# EAGLE design smd_esp8266 (EAGLE 9.6.0)
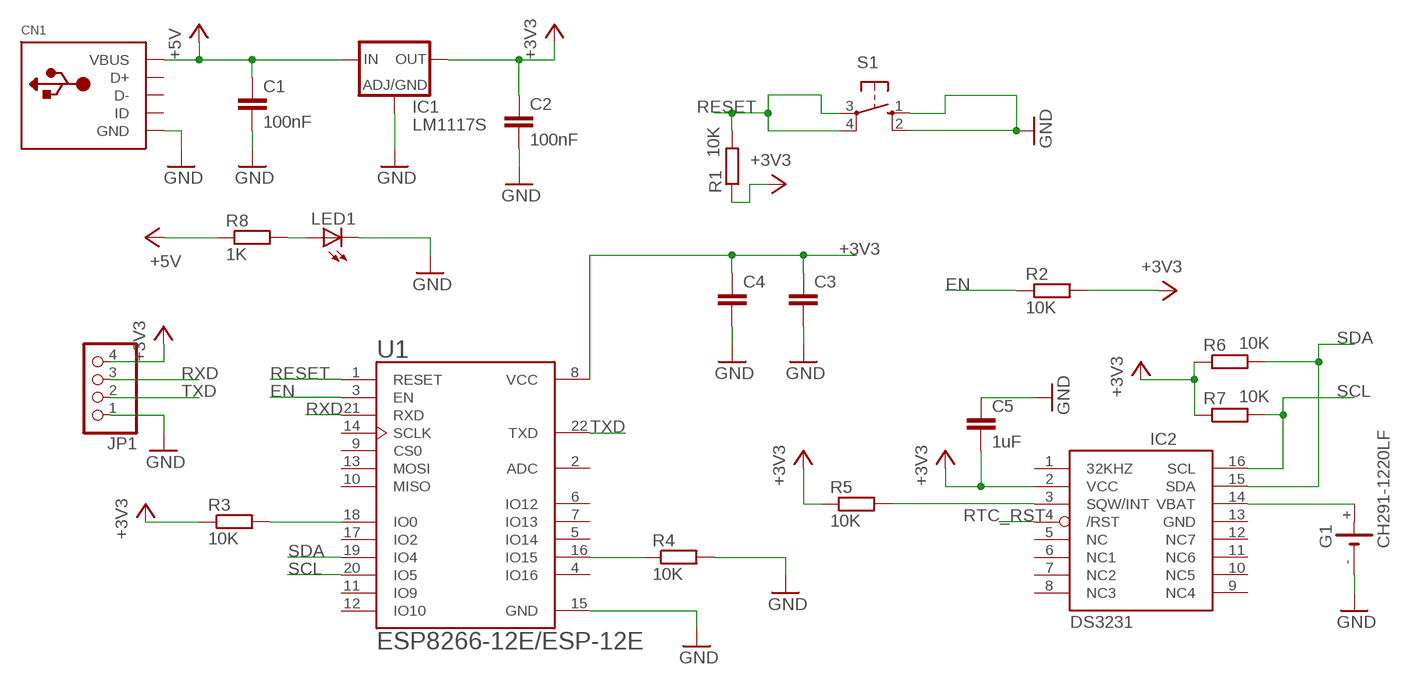
[diagram p0: schematic, sheet 1]

## Parts
C1  100nF  C-EUC0805  [C0805]
C2  100nF  C-EUC0805  [C0805]
C3  C-EUC0805  [C0805]
C4  C-EUC0805  [C0805]
C5  1uF  C-EUC0805  [C0805]
CN1  USBMINIB  [USB-MINIB]
G1  CH291-1220LF  [CH291-1220LF]
IC1  LM1117S  [SOT223]
IC2  DS3231/SO  [SO16W]
JP1  PINHD-1X4  [1X04]
LED1  LEDCHIP-LED0805  [CHIP-LED0805]
R1  10K  R-EU_R0805  [R0805]
R2  10K  R-EU_R0805  [R0805]
R3  10K  R-EU_R0805  [R0805]
R4  10K  R-EU_R0805  [R0805]
R5  10K  R-EU_R0805  [R0805]
R6  10K  R-EU_R0805  [R0805]
R7  10K  R-EU_R0805  [R0805]
R8  1K  R-EU_R0805  [R0805]
S1  10-XX  [B3F-10XX]
U1  ESP8266-12E/ESP-12E  [XCVR_ESP8266-12E/ESP-12E]

## Nets
+3V3: C2.1 C3.1 C4.1 C5.2 IC1.2(OUT) IC1.4(OUT) IC2.2(VCC) JP1.4 R1.1 R2.2 R3.1 R5.1 R6.1 R7.1 U1.8(VCC)
+5V: C1.1 CN1.VBUS IC1.3(IN) R8.1
EN: R2.1 U1.3(EN)
GND: C1.2 C2.2 C3.2 C4.2 C5.1 CN1.GND G1.- IC1.1(ADJ) JP1.1 LED1.C R4.2 S1.1(S) S1.2(S1) U1.15(GND)
N$1: R3.2 U1.18(IO0)
N$2: R4.1 U1.16(IO15)
N$3: IC2.3(SQW/INT) R5.2
N$4: G1.+ IC2.14(VBAT)
N$5: LED1.A R8.2
RESET: R1.2 S1.3(P) S1.4(P1) U1.1(RESET)
RTC_RST: IC2.4(/RST)
RXD: JP1.3 U1.21(RXD)
SCL: IC2.16(SCL) R7.2 U1.20(IO5)
SDA: IC2.15(SDA) R6.2 U1.19(IO4)
TXD: JP1.2 U1.22(TXD)
Unconnected: CN1.D+ CN1.D- CN1.ID IC2.1(32KHZ) IC2.5(NC) IC2.6(NC1) IC2.7(NC2) IC2.8(NC3) IC2.9(NC4) IC2.10(NC5) IC2.11(NC6) IC2.12(NC7) U1.2(ADC) U1.4(IO16) U1.5(IO14) U1.6(IO12) U1.7(IO13) U1.9(CS0) U1.10(MISO) U1.11(IO9) U1.12(IO10) U1.13(MOSI) U1.14(SCLK) U1.17(IO2)

## Power pins joined to a net without a drawn wire
GND: IC2.13(GND)

## Library data of the parts
C1-C5 = rcl:C-EU: CAPACITOR, European symbol; SPICEPREFIX: C
CN1 = adafruit:USB: USB Connectors USBMINIB - Surface Mount Female Mini-B USB Connector 4UConnector: 06564 By microbuilder.eu Thru-hole RA Female Mini-B USB Connector 4UConnector: 18732 By ladyada.net
G1 = battery:CH291-1220LF: Battery Holder, SMT, 12mm multicomp PART NO. CH291-1220LF Source: Data sheet <http://www.farnell.com/datasheets/1505860.pdf>
IC1 = LM1117:LM1117: Low drop fixed and adjustable positive voltage regulators 1 A Source: http://www.st.com/stonline/products/literature/ds/7194/ld1117axx.pdf; AVAILABILITY: Unavailable; DESCRIPTION: Linear Voltage Regulator IC 1 Output 800mA SOT-223-4; MF: Texas Instruments; MP: LM1117; PACKAGE: SOT-223-4 Texas Instruments; PRICE: None
IC2 = DS3231:DS3231; AVAILABILITY: Unavailable; DESCRIPTION: Real Time Clock _RTC_ IC Clock/Calendar I²C, 2-Wire Serial 16-SOIC _0.295, 7.50mm Width_; MF: Maxim Integrated; MP: DS3231; PACKAGE: SOIC-16 Maxim Integrated; PRICE: None
JP1 = pinhead:PINHD-1X4: PIN HEADER
LED1 = adafruit:LED: LED OSRAM: - CHIPLED LG R971, LG N971, LY N971, LG Q971, LY Q971, LO R971, LY R971 LH N974, LH R974 LS Q976, LO Q976, LY Q976 LO Q996 - Hyper CHIPLED LW Q18S LB Q993, LB Q99A, LB R99A - SideLED LS A670, LO A670, LY A670, LG A670, LP A670 LB A673, LV A673, LT A673, LW A673 LH A674 LY A675 LS A676, LA A676, LO A676, LY A676, LW A676 LS A679, LY A679, LG A679 - Hyper Micro SIDELED® LS Y876, LA Y876, LO Y876, LY Y876 LT Y87S - SmartLED LW L88C, LW L88S LB L89C, LB L89S, LG L890 LS L89K, LO L89K, LY L89K LS L896, LA L896, LO L896, LY L896 - TOPLED LS T670, LO T670, LY T670, LG T670, LP T670 LSG T670, LSP T670, LSY T670, LOP T670, LYG T670 LG T671, LOG T671, LSG T671 LB T673, LV T673, LT T673, LW T673 LH T674 LS T676, LA T676, LO T676, LY T676, LB T676, LH T676, LSB T676, LW T676 LB T67C, LV T67C, LT T67C, LS T67K, LO T67K, LY T67K, LW E67C LS E67B, LA E67B, LO E67B, LY E67B, LB E67C, LV E67C, LT E67C LW T67C LS T679, LY T679, LG T679 LS T770, LO T770, LY T770, LG T770, LP T770 LB T773, LV T773, LT T773, LW T773 LH T774 LS E675, LA E675, LY E675, LS T675 LS T776, LA T776, LO T776, LY T776, LB T776 LHGB T686 LT T68C, LB T68C - Hyper Mini TOPLED® LB M676 - Mini TOPLED Santana® LG M470 LS M47K, LO M47K, LY M47K Source: http://www.osram.convergy.de/
R1-R8 = rcl:R-EU_: RESISTOR, European symbol; SPICEPREFIX: R
S1 = switch-omron:10-XX: OMRON SWITCH; MPN: B3F-1000; OC_FARNELL: 176432; OC_NEWARK: 36M3542
U1 = ESP8266-12E_ESP-12E:ESP8266-12E/ESP-12E: ESP-12E WiFi Module; AVAILABILITY: Unavailable; DESCRIPTION: This WiFi module has a 32-bit MCU micro and clock speeds supporting 80 MHz or 160 MHz. Supports the RTOS and integrated Wi-Fi MAC/BB/RF/PA/LNA, and has an on-board antenna.; MF: AI-Thinker; MP: ESP8266-12E/ESP-12E; PACKAGE: None; PRICE: None

## Board
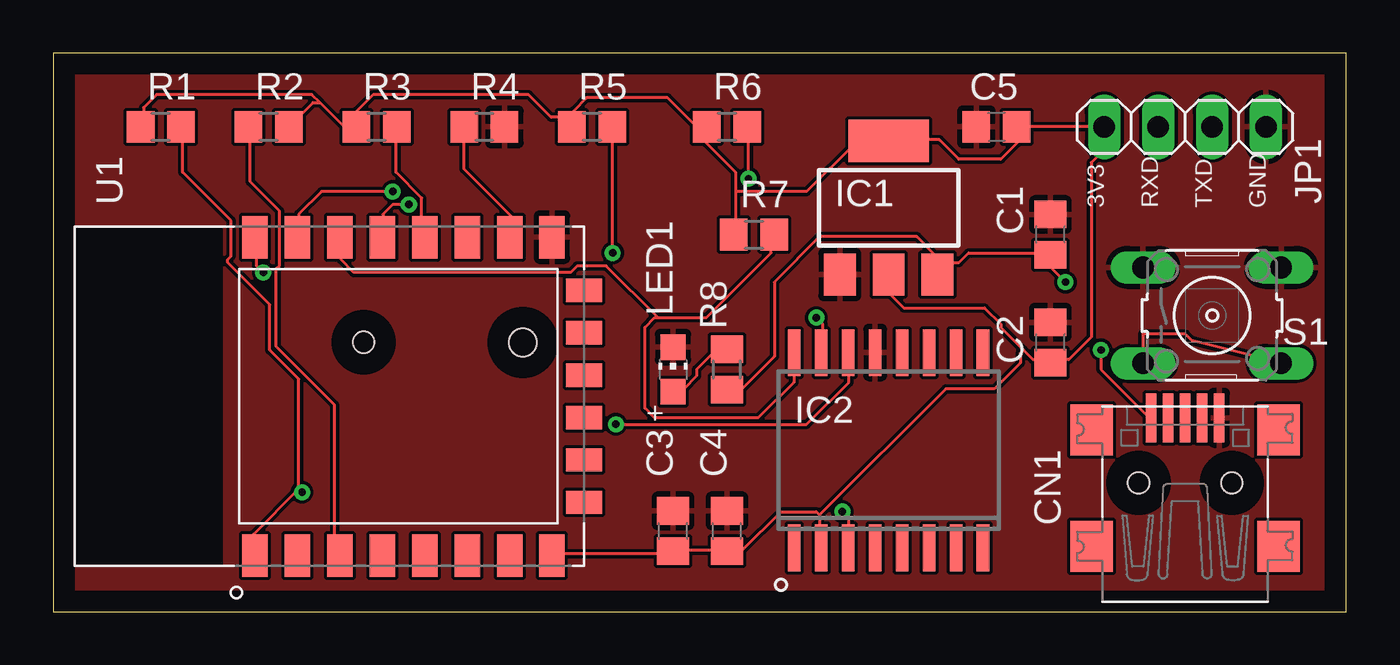
[diagram p1: board, top side]
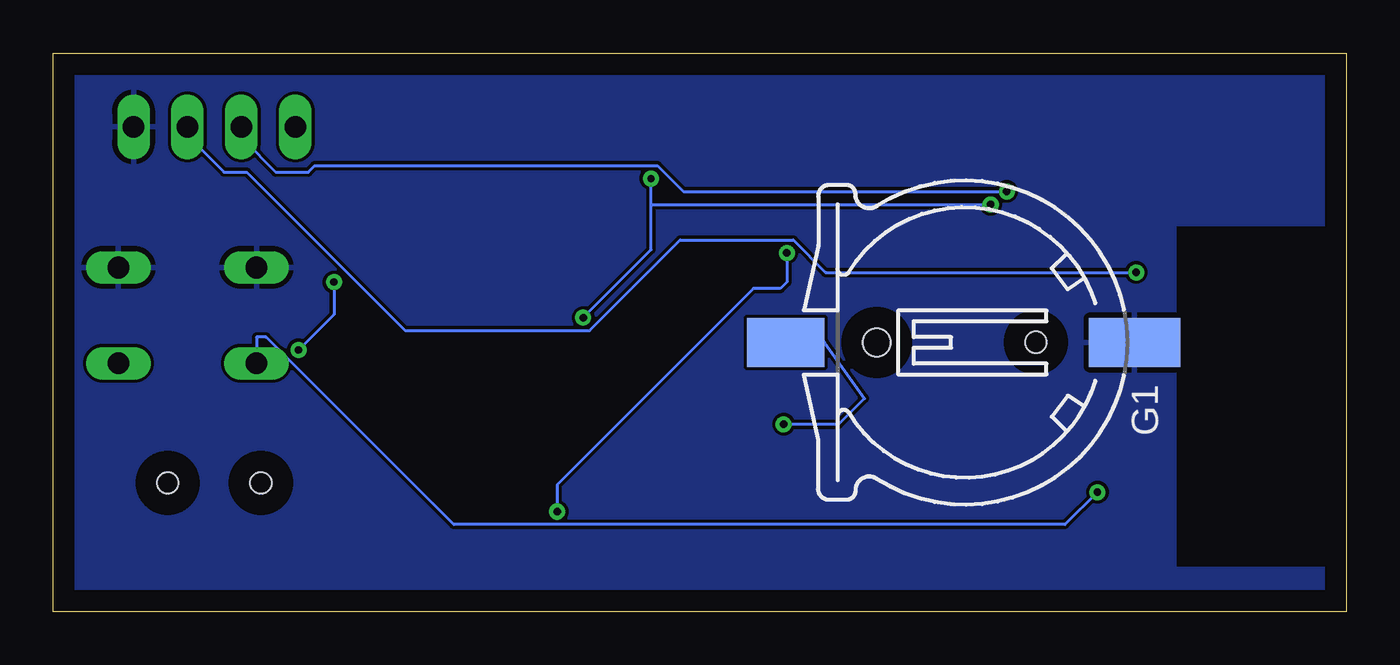
[diagram p2: board, bottom side, seen from below]

Size 60.94 x 26.34 mm. Coordinates in mm from the lower left corner, seen from the top.
Outline: 0,0 60.94,0 60.94,26.34 0,26.34 0,0
Copper layers (1*16): Top 0.035mm / dielectric 1.5mm / Bottom 0.035mm
Design rules "default": minimum track width 6mil, minimum drill 0.35mm, track to track 6mil, track to pad 6mil, pad to pad 6mil, via to via 6mil, smd to smd 6mil, copper to edge 40mil, drill to drill 6mil, minimum pad ring 10mil, minimum via ring 8mil, stop-mask expansion 4mil, vias tented up to drill 0mil, thermal gap 10mil

### Footprints (pad centres in the part's own frame; a part is rotated, then mirrored left to right if it is on the bottom)
C0805 = smd 1.3 x 1.5: 1 -0.95,0; 2 0.95,0
USB-MINIB = smd 0.5 x 2.308: D+ 0,4.064; D- -0.8,4.064; GND 1.6,4.064; ID 0.8,4.064; VBUS -1.6,4.064 | smd 2 x 2.4: GND1 -4.4,-2; GND2 -4.4,3.5; GND3 4.4,3.5; GND4 4.4,-2 | hole 1: -2.2,1; 2.2,1
CH291-1220LF = smd 2.3 x 3.66: + 0,-2.296 | smd 2.3 x 4.3: - 0,14.146 | hole 1.3: 0,2 | hole 1: 0,9.5
SOT223 = smd 1.5 x 2: 1 -2.3,-3.15; 2 0,-3.15; 3 2.3,-3.15 | smd 3.8 x 2: 4 0,3.15
SO16W = smd 0.6 x 2.2: 1 -4.445,-4.6; 2 -3.175,-4.6; 3 -1.905,-4.6; 4 -0.635,-4.6; 5 0.635,-4.6; 6 1.905,-4.6; 7 3.175,-4.6; 8 4.445,-4.6; 9 4.445,4.6; 10 3.175,4.6; 11 1.905,4.6; 12 0.635,4.6; 13 -0.635,4.6; 14 -1.905,4.6; 15 -3.175,4.6; 16 -4.445,4.6
1X04 = drill 1.016 long: 1 -3.81,0; 2 -1.27,0; 3 1.27,0; 4 3.81,0
CHIP-LED0805 = smd 1.2 x 1.2: A 0,-1.05; C 0,1.05
R0805 = smd 1.3 x 1.5: 1 -0.95,0; 2 0.95,0
B3F-10XX = drill 1.016 long: 1 -3.251,2.261; 2 3.251,2.261; 3 -3.251,-2.261; 4 3.251,-2.261
XCVR_ESP8266-12E/ESP-12E = smd 2 x 1.2: 1 -7.5,7; 2 -7.5,5; 3 -7.5,3; 4 -7.5,1; 5 -7.5,-1; 6 -7.5,-3; 7 -7.5,-5; 8 -7.5,-7; 15 7.5,-7; 16 7.5,-5; 17 7.5,-3; 18 7.5,-1; 19 7.5,1; 20 7.5,3; 21 7.5,5; 22 7.5,7 | smd 1.1 x 1.7: 9 -5,-8.5; 10 -3,-8.5; 11 -1,-8.5; 12 1,-8.5; 13 3,-8.5; 14 5,-8.5

### Placement (x,y rotation side)
C1  46.99,17.78 90 top
C2  46.99,12.7 90 top
C3  29.21,3.81 90 top
C4  31.75,3.81 90 top
C5  44.45,22.86 0 top
CN1  53.34,5.08 0 top
G1  24.13,12.7 270 bottom
IC1  39.37,19.05 0 top
IC2  39.37,7.62 0 top
JP1  53.34,22.86 180 top
LED1  29.21,11.43 0 top
R1  5.08,22.86 0 top
R2  10.16,22.86 0 top
R3  15.24,22.86 0 top
R4  20.32,22.86 0 top
R5  25.4,22.86 0 top
R6  31.75,22.86 0 top
R7  33.02,17.78 0 top
R8  31.75,11.43 90 top
S1  54.61,13.97 0 top
U1  16.51,10.16 90 top

### Tracks (layer width: path | path; a pad name or v marks a point on that pad's centre or on a via)
+3V3
  Top 0.152: 12.57,24 13.72,22.86 R3.1 14.33,22.86 14.33,23.62 15.09,24.38 22.4,24.38 23.47,23.32 24.54,23.32 | 12.57,24 12.19,24.38 4.88,24.38 4.27,23.77 4.27,22.86 R1.1 | 24.54,23.32 24.54,23.62 25.15,24.23 28.96,24.23 30.33,22.86 30.79,22.86 | 24.54,23.32 24.54,22.86 R5.1 24.54,23.32 | 32.16,19.81 32.16,20.73 30.79,22.1 30.79,22.86 | 32.16,19.81 32.16,17.83 R7.1 | 30.79,22.86 R6.1 | U1.8 23.62,2.74 29.11,2.74 C3.1 29.26,2.9 31.7,2.9 C4.1 31.85,2.9 32.46,2.9 34.29,4.72 35.97,4.72 36.12,4.57 | 36.12,4.57 36.12,3.05 IC2.2 | 45.72,12.34 44.65,13.41 44.65,13.56 43.89,14.33 40.08,14.33 39.47,14.94 39.47,15.85 IC1.2 | 45.72,12.34 46.18,11.89 46.94,11.89 C2.1 47.09,11.89 47.85,11.89 48.92,12.95 48.92,21.18 49.23,21.49 49.23,22.86 | 49.23,22.86 45.41,22.86 | 45.41,22.86 45.41,22.1 44.65,21.34 42.67,21.34 41.76,22.25 39.47,22.25 IC1.4 39.32,22.1 37.8,22.1 35.51,19.81 32.16,19.81 | 45.41,22.86 C5.2 | 49.23,22.86 JP1.4 | 36.12,4.57 42.06,10.52 44.35,10.52 45.57,11.73 45.57,12.19 45.72,12.34 | R2.2 12.25,24 12.57,24
+5V  (via drill 0.35)
  Top 0.152: 41.6,16.46 41.6,16 IC1.3 41.6,16.46 | 41.6,16.46 41.6,16.76 40.69,17.68 36.12,17.68 33.98,15.54 33.98,12.04 32.46,10.52 31.85,10.52 R8.1 | 41.6,16.46 42.67,16.46 43.13,16.92 46.94,16.92 C1.1 47.09,16.76 47.09,16.15 v47.7,15.54 | v49.38,12.34 49.38,11.43 51.66,9.14 CN1.VBUS
  Bottom 0.152: v49.38,12.34 47.7,14.02 v47.7,15.54
EN
  Top 0.152: R2.1 9.3,22.86 9.3,20.27 10.67,18.9 10.67,16.31 10.52,16.15 10.52,12.5 13.26,9.75 13.26,2.9 13.41,2.74 U1.3
GND
  pour Top: 0,0 60.96,0 60.96,26.67 0,26.67
  pour Bottom: 0,0 60.96,0 60.96,26.67 0,26.67
N$1
  Top 0.152: R3.2 16.15,22.86 16.15,20.73 17.37,19.51 17.37,17.68 U1.18
N$2
  Top 0.152: R4.1 19.36,22.86 19.36,20.88 21.64,18.59 21.64,17.68 U1.16
N$3  (via drill 0.35)
  Top 0.152: v26.36,16.92 26.36,22.86 R5.2 | v37.19,4.72 37.49,4.42 37.49,3.05 IC2.3
  Bottom 0.152: v26.36,16.92 26.36,15.54 26.67,15.24 27.94,15.24 37.19,5.99 v37.19,4.72
N$4  (via drill 0.35)
  Top 0.152: v26.52,8.84 35.51,8.84 37.49,10.82 37.49,12.19 IC2.14
  Bottom 0.152: v26.52,8.84 23.93,8.84 22.71,10.06 24.59,12.7 G1.+
N$5
  Top 0.152: LED1.A 29.26,10.52 29.72,10.52 30.33,11.12 30.33,11.43 31.24,12.34 31.7,12.34 R8.2
RESET  (via drill 0.35)
  Top 0.152: S1.3 51.36,13.11 53.34,13.11 53.65,12.8 57.81,11.76 S1.4 | 11.58,5.79 11.58,10.97 10.21,12.34 10.21,14.48 8.23,16.46 8.23,16.61 8.38,16.76 8.38,18.44 6.1,20.73 6.1,22.86 R1.2 | 11.58,5.79 9.45,3.66 9.45,2.74 U1.1 | 11.58,5.79 v11.73,5.64
  Bottom 0.152: v11.73,5.64 13.26,4.12 42.06,4.12 50.9,12.95 51.36,12.95 S1.3
RXD  (via drill 0.35)
  Top 0.152: v16,19.81 12.65,19.81 11.58,18.75 11.58,17.68 U1.21
  Bottom 0.152: v16,19.81 31.24,19.81 32.46,21.03 48.62,21.03 48.92,20.73 50.44,20.73 51.97,22.25 51.97,22.86 JP1.3
SCL
  Top 0.152: 28.5,13.87 28.35,13.87 27.89,13.41 27.89,9.6 28.35,9.14 33.22,9.14 34.9,10.82 34.9,12.19 IC2.16 | 28.5,13.87 30.79,13.87 33.83,16.92 33.83,17.68 R7.2 | 28.5,13.87 26.06,16.31 24.69,16.31 24.38,16 14.17,16 13.56,16.61 13.56,17.53 U1.20
SDA  (via drill 0.35)
  Top 0.152: v32.77,20.42 32.77,22.86 R6.2 | v35.97,13.87 36.27,13.56 36.27,12.34 IC2.15 | v16.76,19.2 16,19.2 15.54,18.75 15.54,17.68 U1.19
  Bottom 0.152: 32.77,19.2 32.77,17.07 v35.97,13.87 | 32.77,19.2 v32.77,20.42 | 32.77,19.2 v16.76,19.2
TXD  (via drill 0.35)
  Top 0.152: v9.91,16 9.6,16.31 9.6,17.53 U1.22
  Bottom 0.152: v9.91,16 24.54,16 26.06,17.53 31.39,17.53 35.66,13.26 44.35,13.26 51.82,20.73 52.88,20.73 54.56,22.4 54.56,22.86 JP1.2

### Text on the board
tNames: 3V3 | RXD | TXD | GND